# Altium schematic sheet RF_VCO.SchDoc
size A4
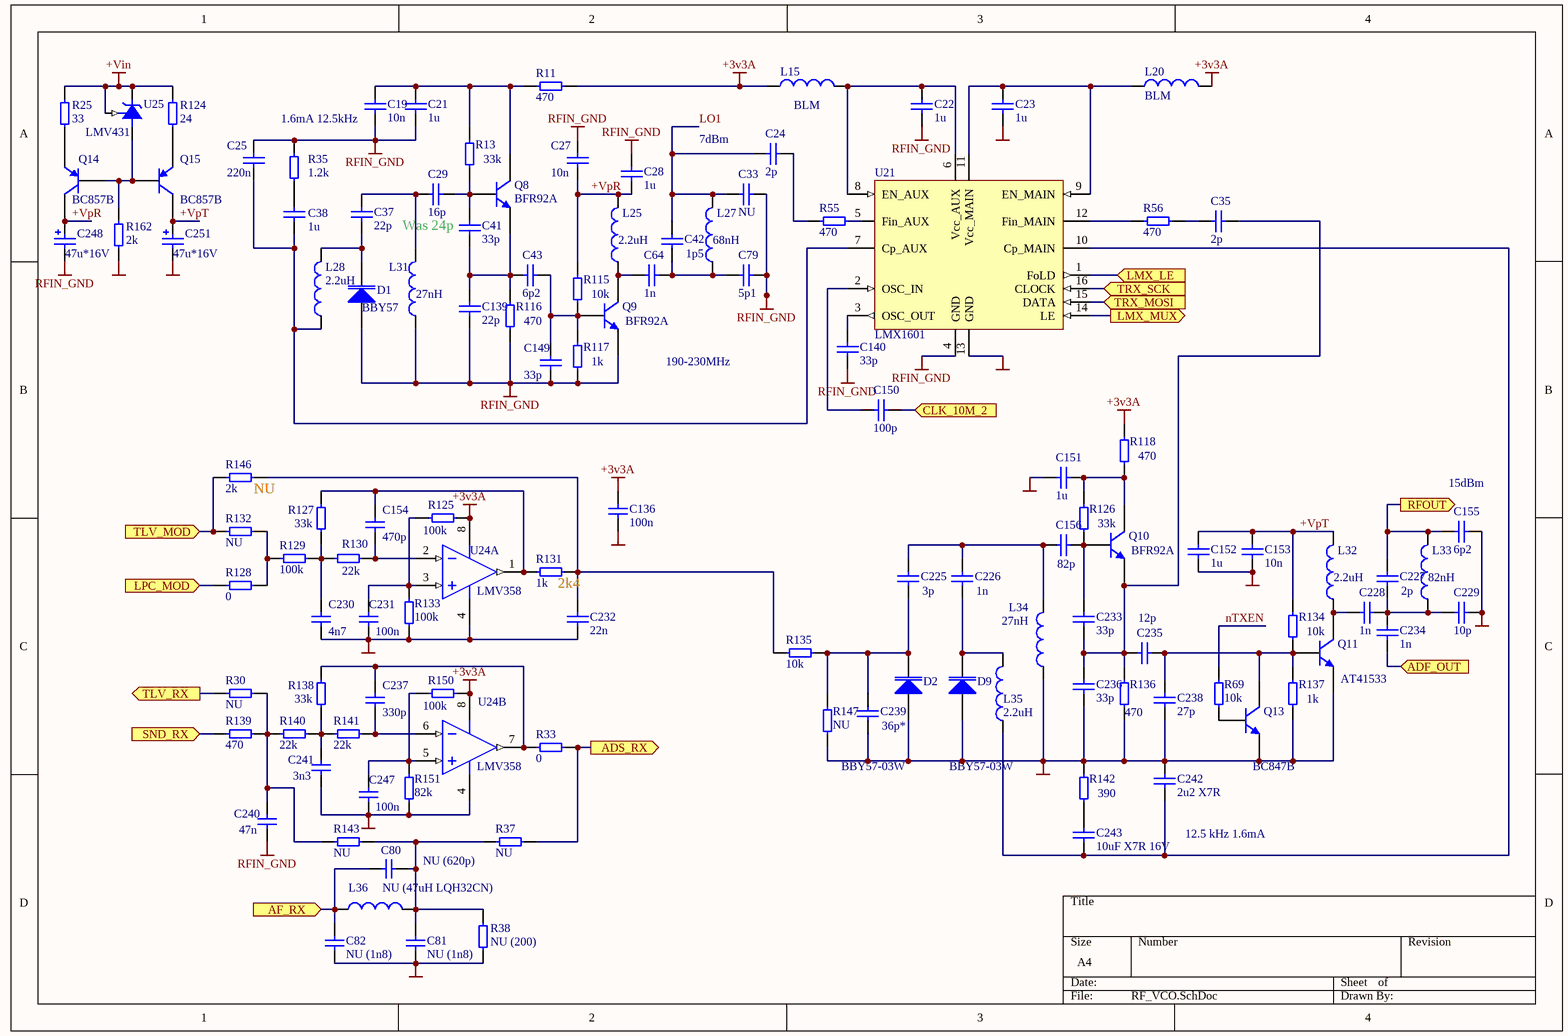
[diagram p0: RF_VCO.SchDoc]

## Parts
C19  10n  [CAPC1608L]
C21  1u  [CAPC2012L]
C22  1u  [CAPC2012L]
C23  1u  [CAPC2012L]
C24  2p  [CAPC1608L]
C25  220n  [CAPC1608L]
C27  10n  [CAPC1608L]
C28  1u  [CAPC2012L]
C29  16p  [CAPC1608L]
C33  NU  [CAPC1608L]
C35  2p  [CAPC1608L]
C37  22p  [CAPC1608L]
C38  1u  [CAPC2012L]
C41  33p  [CAPC1608L]
C42  1p5  [CAPC1608L]
C43  6p2  [CAPC1608L]
C64  1n  [CAPC1608L]
C79  5p1  [CAPC1608L]
C80  NU (620p)  [CAPC1608L]
C81  NU (1n8)  [CAPC1608L]
C82  NU (1n8)  [CAPC1608L]
C136  100n  [CAPC1608L]
C139  22p  [CAPC1608L]
C140  33p  [CAPC1608L]
C149  33p  [CAPC1608L]
C150  100p  [CAPC1608L]
C151  1u  [CAPC2012L]
C152  1u  [CAPC2012L]
C153  10n  [CAPC1608L]
C154  470p  [CAPC1608L]
C155  6p2  [CAPC1608L]
C156  82p  [CAPC1608L]
C225  3p  [CAPC1608L]
C226  1n  [CAPC1608L]
C227  2p  [CAPC1608L]
C228  1n  [CAPC1608L]
C229  10p  [CAPC1608L]
C230  4n7  [CAPC1608L]
C231  100n  [CAPC1608L]
C232  22n  [CAPC1608L]
C233  33p  [CAPC1608L]
C234  1n  [CAPC1608L]
C235  12p  [CAPC1608L]
C236  33p  [CAPC1608L]
C237  330p  [CAPC1608L]
C238  27p  [CAPC1608L]
C239  36p*  [CAPC1608L]
C240  47n  [CAPC1608L]
C241  3n3  [CAPC1608L]
C242  2u2 X7R  [CAPC2012L]
C243  10uF X7R 16V  [CAPC3216M]
C247  100n  [CAPC1608L]
C248  47u*16V  [Case_C]
C251  47u*16V  [Case_C]
D1  BBY57  [SOD-323]
D2  BBY57-03W  [SOD-323]
D9  BBY57-03W  [SOD-323]
L15  BLM  [CAPC2012N]
L20  BLM  [CAPC2012N]
L25  2.2uH  [INDC2012L]
L27  68nH  [INDC2012L]
L28  2.2uH  [INDC2012L]
L31  27nH  [INDC2012L]
L32  2.2uH  [INDC2012L]
L33  82nH  [INDC2012L]
L34  27nH  [INDC2012L]
L35  2.2uH  [INDC2012L]
L36  NU (47uH LQH32CN)  [CAPC3225N]
Q8  BFR92A  [SOT-23]
Q9  BFR92A  [SOT-23]
Q10  BFR92A  [SOT-23]
Q11  AT41533  [SOT-23]
Q13  BC847B  [SOT23_N]
Q14  BC857B  [SOT23_N]
Q15  BC857B  [SOT23_N]
R11  470  [RESC1608L]
R13  33k  [RESC1608L]
R25  33  [RESC1608L]
R30  NU  [RESC1608L]
R33  0  [RESC1608L]
R35  1.2k  [RESC1608L]
R37  NU  [RESC1608L]
R38  NU (200)  [RESC1608L]
R55  470  [RESC1608L]
R56  470  [RESC1608L]
R69  10k  [RESC1608L]
R115  10k  [RESC1608L]
R116  470  [RESC1608L]
R117  1k  [RESC1608L]
R118  470  [RESC1608L]
R124  24  [RESC1608L]
R125  100k  [RESC1608L]
R126  33k  [RESC1608L]
R127  33k  [RESC1608L]
R128  0  [RESC1608L]
R129  100k  [RESC1608L]
R130  22k  [RESC1608L]
R131  1k  [RESC1608L]
R132  NU  [RESC1608L]
R133  100k  [RESC1608L]
R134  10k  [RESC1608L]
R135  10k  [RESC1608L]
R136  470  [RESC1608L]
R137  1k  [RESC1608L]
R138  33k  [RESC1608L]
R139  470  [RESC1608L]
R140  22k  [RESC1608L]
R141  22k  [RESC1608L]
R142  390  [RESC1608L]
R143  NU  [RESC1608L]
R146  2k  [RESC1608L]
R147  NU  [RESC1608L]
R150  100k  [RESC1608L]
R151  82k  [RESC1608L]
R162  2k  [RESC1608L]
U21  LMX1601  [TSSOP65P640X120-16N]
U24  LMV358  [SOIC-150-8]  (parts A,B of 2)
U25  LMV431  [MF03A_N]

## Ports
ADF_OUT (in), ADS_RX (out), AF_RX (in), CLK_10M_2 (in), LMX_LE (in), LMX_MUX (out), LPC_MOD (in), RFOUT (out), SND_RX (in), TLV_MOD (in), TLV_RX (out), TRX_MOSI (in), TRX_SCK (in)

## Nets
+3v3A: C136.1 L15.2 L20.2 R11.2 R118.1 R125.2 R150.2 U24.8(V+)
+Vin: R25.2 R124.2 U25.1(REF) U25.2(K)
GND: C23.1 C81.1 C82.1 C136.2 C151.2 C152.1 C153.1 C155.2 C229.2 C230.2 C231.2 C232.2 C236.2 C238.2 C239.1 C241.2 C242.1 C247.2 C251.2 D2.2(A) D9.2(A) L34.1 Q11.2(E) Q13.2(E) R38.2 R133.2 R136.2 R137.2 R142.1 R147.1 R151.2 R162.1 U21.13(GND) U24.4(V-)
RFIN_GND: C19.1 C21.1 C22.1 C25.1 C27.1 C28.1 C33.2 C79.2 C139.2 C140.2 C149.2 C240.2 C248.2 D1.2(A) L31.1 Q9.2(E) R35.1 R116.2 R117.2 U21.4(GND)
+VpR: C27.2 C28.2 C248.1 L25.2 Q14.3(C) R115.1
+VpT: C152.2 C153.2 C251.1 L32.2 Q15.3(C) R134.1
ADF_OUT: C234.2 ; port ADF_OUT
ADS_RX: R33.2 R37.1 ; port ADS_RX
AF_RX: C80.2 C82.2 L36.1 ; port AF_RX
CLK_10M_2: C150.2 ; port CLK_10M_2
LMX_LE: U21.1(FoLD) ; port LMX_LE
LMX_MUX: U21.14(LE) ; port LMX_MUX
LO1: C24.1 C33.1 C42.2 L27.2
LPC_MOD: R128.1 ; port LPC_MOD
nTXEN: R69.1
RFOUT: C155.1 C227.2 L33.2 ; port RFOUT
SND_RX: R139.2 ; port SND_RX
TLV_MOD: R132.1 R146.1 ; port TLV_MOD
TLV_RX: R30.2 ; port TLV_RX
TRX_MOSI: U21.15(DATA) ; port TRX_MOSI
TRX_SCK: U21.16(CLOCK) ; port TRX_SCK
NetC19_2: C19.2 C21.2 Q8.3(C) R11.1 R13.1
NetC22_2: C22.2 L15.1 U21.6(Vcc_AUX) U21.8(EN_AUX)
NetC23_2: C23.2 L20.1 U21.9(EN_MAIN) U21.11(Vcc_MAIN)
NetC24_2: C24.2 R55.1
NetC25_2: C25.2 C38.2 L28.1 U21.7(Cp_AUX)
NetC29_1: C29.1 C41.1 Q8.1(B) R13.2
NetC29_2: C29.2 C37.2 L31.2
NetC35_1: C35.1 R56.2
NetC35_2: C35.2 C233.2 C235.1 C236.1 Q10.2(E) R136.1
NetC37_1: C37.1 D1.1(K) L28.2
NetC38_1: C38.1 R35.2
NetC41_2: C41.2 C43.2 C139.1 Q8.2(E) R116.1
NetC42_1: C42.1 C64.1 C79.1 L27.1
NetC43_1: C43.1 C149.1 Q9.1(B) R115.2 R117.1
NetC64_2: C64.2 L25.1 Q9.3(C)
NetC80_1: C80.1 C81.2 L36.2 R37.2 R38.1 R143.2
NetC140_1: C140.1 U21.3(OSC_OUT)
NetC150_1: C150.1 U21.2(OSC_IN)
NetC151_1: C151.1 Q10.3(C) R118.2 R126.1
NetC154_1: C154.1 R127.1 R131.1 U24.1(OUTA)
NetC154_2: C154.2 R130.2 U24.2(INA-)
NetC156_1: C156.1 C233.1 Q10.1(B) R126.2
NetC156_2: C156.2 C225.2 C226.2 L34.2
NetC225_1: C225.1 C239.2 D2.1(K) R135.2 R147.2
NetC226_1: C226.1 D9.1(K) L35.2
NetC227_1: C227.1 C228.1 C229.1 C234.1 L33.1
NetC228_2: C228.2 L32.1 Q11.3(C)
NetC230_1: C230.1 R127.2 R129.2 R130.1
NetC231_1: C231.1 R125.1 R133.1 U24.3(INA+)
NetC232_1: C232.1 R131.2 R135.1 R146.2
NetC235_2: C235.2 C238.1 Q11.1(B) Q13.3(C) R134.2 R137.1
NetC237_1: C237.1 R33.1 R138.1 U24.7(OUTB)
NetC237_2: C237.2 R141.1 U24.6(INB-)
NetC240_1: C240.1 R30.1 R139.1 R140.2 R143.1
NetC241_1: C241.1 R138.2 R140.1 R141.2
NetC242_2: C242.2 C243.1 L35.1 U21.10(Cp_MAIN)
NetC243_2: C243.2 R142.2
NetC247_1: C247.1 R150.1 R151.1 U24.5(INB+)
NetQ13_1: Q13.1(B) R69.2
NetQ14_1: Q14.1(B) Q15.1(B) R162.2 U25.3(A)
NetQ14_2: Q14.2(E) R25.1
NetQ15_2: Q15.2(E) R124.1
NetR55_2: R55.2 U21.5(Fin_AUX)
NetR56_1: R56.1 U21.12(Fin_MAIN)
NetR128_2: R128.2 R129.1 R132.2

## Notes on the sheet
- 1.6mA 12.5kHz
- 7dBm
- Was 24p
- 190-230MHz
- (near R146) NU
- 15dBm
- (near R131) 2k4
- (near C242) 12.5 kHz 1.6mA

## Library data of the parts
C19 C21-C25 C27-C29 C33 C35 C37 C38 C41-C43 C64 C79-C82 C136 C139 C140 C149-C156 C225-C243 C247 = Cap: Capacitor; Value: 100pF; Published: 8-Jun-2000; LatestRevisionDate: 17-Jul-2002; LatestRevisionNote: Re-released for DXP Platform.; PackageReference: RAD-0.3; Publisher: Altium Limited
C248 C251 = Cap Pol: Polarized Capacitor (Surface Mount); Value: 100pF; Published: 8-Jun-2000; LatestRevisionDate: 17-Jul-2002; LatestRevisionNote: Re-released for DXP Platform.; PackageReference: C0805; Publisher: Altium Limited
D1 D2 D9 = BBY57-03W: Silicon High Q Hyperabrupt Tuning Diode; Published: 21-Mar-2003; LatestRevisionDate: 19-Mar-2004; LatestRevisionNote: Silkscreen size reduced.; DatasheetDocument: Aug-1998; PackageDocument: Sep-2000; PackageReference: SOD-323; Publisher: Altium Limited; ComponentLink1Description: Manufacturer Link; ComponentLink1URL: http://www.infineon.com/
L15 L20 = Ferrite Bead: Code_IEC: 1005; Value: 10mH; Published: 8-Jun-2000; LatestRevisionDate: 17-Jul-2002; LatestRevisionNote: Re-released for DXP Platform.; PackageReference: 0402-A; Publisher: Altium Limited; Code_JEITA: 0402
L25 L27 L28 L31-L36 = INDUCTOR
Q8-Q11 = BFR92A: NPN 5 GHz Wideband Transistor; Published: 17-Sep-2003; LatestRevisionDate: 12-Dec-2006; LatestRevisionNote: IPC-7351 Footprint Added.; DatasheetVersion: 29-Oct-1997; PackageVersion: May-1999; PackageReference: SOT23; Publisher: Altium Limited; PackageDescription: 3-Pin SOT-23 Package 0.95 mm Pitch, 2.3 mm Lead Span; ComponentLink1Description: Manufacturer Link; ComponentLink1URL: http://www.semiconductors.philips.com/; ComponentLink2Description: Datasheet; ComponentLink2URL: http://www.semiconductors.philips.com/acrobat/datasheets/BFR92A_2.pdf
Q13 = BC847B: NPN General-purpose Transistor; Published: 17-Sep-2003; LatestRevisionDate: 12-Dec-2006; LatestRevisionNote: IPC-7351 Footprint Added.; DatasheetVersion: 4-Feb-2002; PackageVersion: May-1999; PackageReference: SOT23; Publisher: Altium Limited; PackageDescription: 3-Pin SOT-23 Package 0.95 mm Pitch, 2.3 mm Lead Span; ComponentLink1Description: Manufacturer Link; ComponentLink1URL: http://www.semiconductors.philips.com/; ComponentLink2Description: Datasheet; ComponentLink2URL: http://www.semiconductors.philips.com/acrobat/datasheets/BC846_BC847_BC848_5.pdf
Q14 Q15 = BC857B: PNP General-purpose Transistor; Published: 17-Sep-2003; LatestRevisionDate: 12-Dec-2006; LatestRevisionNote: IPC-7351 Footprint Added.; DatasheetVersion: 4-Feb-2002; PackageVersion: May-1999; PackageReference: SOT23; Publisher: Altium Limited; PackageDescription: 3-Pin SOT-23 Package 0.95 mm Pitch, 2.3 mm Lead Span; ComponentLink1Description: Manufacturer Link; ComponentLink1URL: http://www.semiconductors.philips.com/; ComponentLink2Description: Datasheet; ComponentLink2URL: http://www.semiconductors.philips.com/acrobat/datasheets/BC856_BC857_BC858_6.pdf
R11 R13 R25 R30 R33 R35 R37 R38 R55 R56 R69 R115 R116 R118 R124-R130 R132-R136 R138-R143 R146 R147 R150 R151 R162 = Res: Resistor; Value: 1K; Published: 8-Jun-2000; LatestRevisionDate: 04-Mar-2005; LatestRevisionNote: PCB Footprint replaced.; PackageReference: J1-0603; Publisher: Altium Limited
R117 R131 R137 = Res: Resistor; Published: 8-Jun-2000; LatestRevisionDate: 04-Mar-2005; LatestRevisionNote: PCB Footprint replaced.; PackageReference: J1-0603; Publisher: Altium Limited; Value: 1K
U21 = LMX1601: Synthesizer
U24 = LMV358M: General Purpose, Low Voltage, Rail-to-Rail Output Operational Amplifiers; Manufacturer: National Semiconductor; PackageTopMarking: NSZXTT*LMV*358M; PowerWise: N; Published: 4-Dec-2008; LatestRevisionDate: 13-Jan-2009; LatestRevisionNote: Sim Model Added.; DatasheetVersion: Oct-2007; PackageVersion: revL, Sep-2006; PackageReference: M08A; Publisher: Altium Limited; PackageDescription: SOIC Narrow, 4.9 x 3.9 x 1.45mm, 8 Lead, 1.27mm Pitch; CompType: Amplifiers; PartNumber: LMV358M; RoHS: O; PinCount: 8; DigiKeyPartNumber: LMV358MMCT-ND; Code_JEDEC: MS-012-AA; Code_IPC: SOIC127P600-8; ComponentLink1Description: LMV358 Datasheet; ComponentLink1URL: http://www.national.com/ds/LM/LMV358.pdf; ComponentLink2Description: LMV358 Web Page; ComponentLink2URL: http://www.national.com/pf/LM/LMV358.html; ComponentLink3Description: M08A Package Page; ComponentLink3URL: http://www.national.com/packaging/folders/m08a.html
U25 = LMV431AIMF: Low-Voltage (1.24V) Adjustable Precision Shunt Regulator; Manufacturer: National Semiconductor; CompType: MiscPower; PackageTopMarking: RLA*XTT; PowerWise: N; FirstPublished: 4-Dec-2008; DatasheetVersion: May-2005; PackageVersion: revB, Mar-2003; PackageReference: MF03A; Publisher: Altium Limited; PackageDescription: Molded SOT-23, .115 x .051 x .037in Body, 3 Lead, .075 in Pitch; PartNumber: LMV431AIMF; RoHS: Y; PinCount: 3; DigiKeyPartNumber: LMV431AIMF-ND; ComponentLink1Description: LMV431 Datasheet; ComponentLink1URL: http://www.national.com/ds/LM/LMV431.pdf; ComponentLink2Description: LMV431A Web Page; ComponentLink2URL: http://www.national.com/pf/LM/LMV431A.html; ComponentLink3Description: MF03A Package Page; ComponentLink3URL: http://www.national.com/packaging/folders/mf03a.html